# EAGLE design 7seg (EAGLE 6.1)
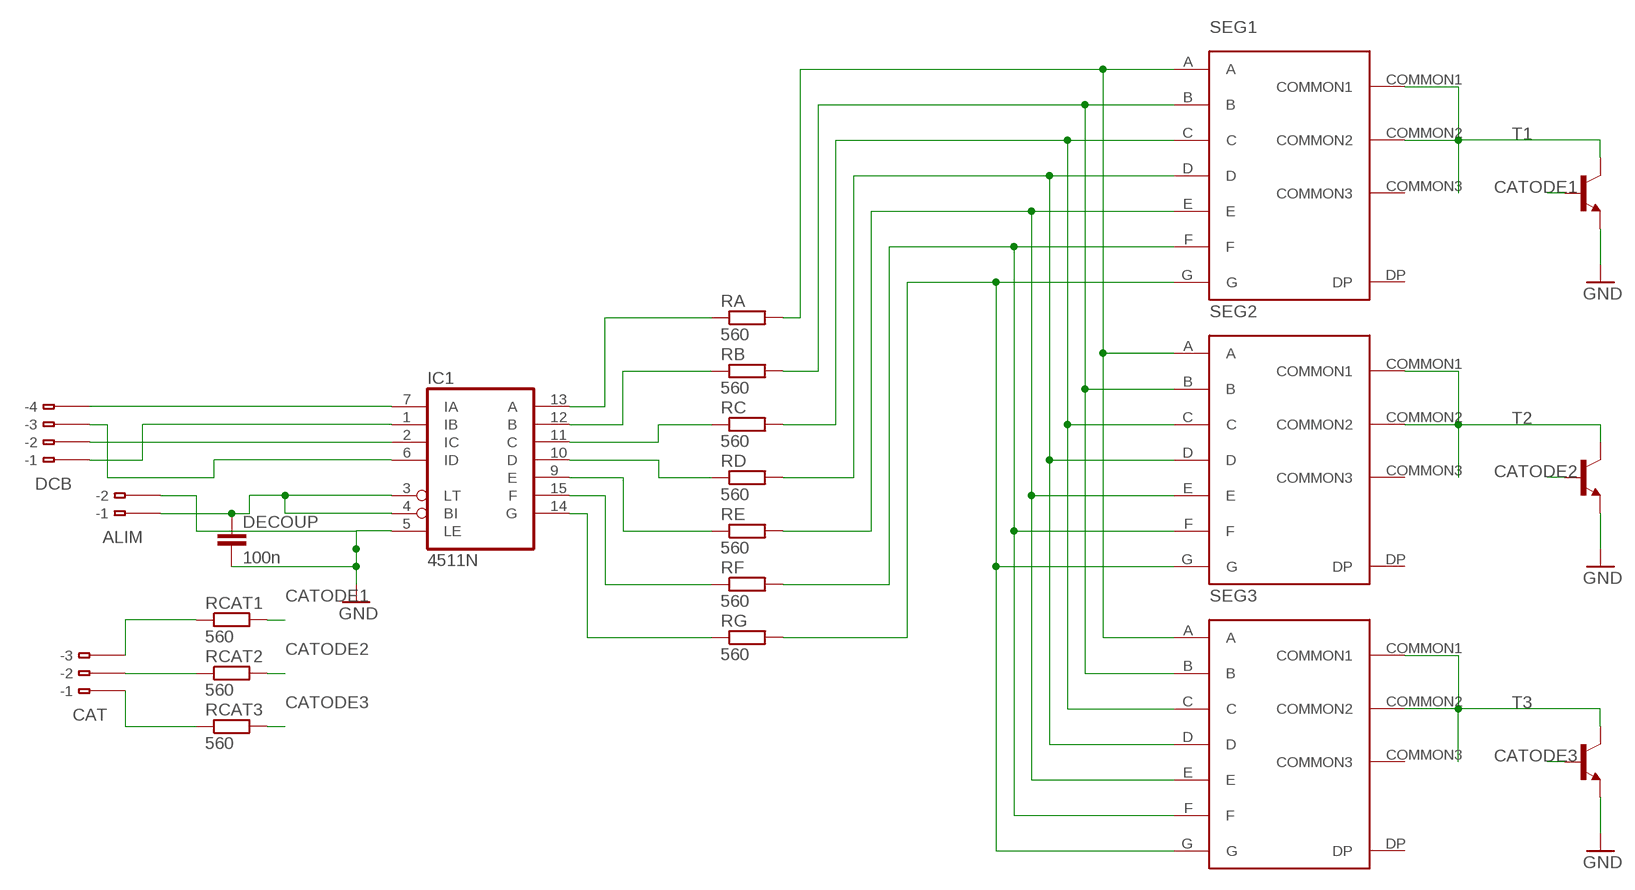
[diagram p0: schematic, sheet 1]

## Parts
ALIM  233-102  [233-102]
CAT  233-103  [233-103]
DCB  233-104  [233-104]
DECOUP  100n  C-EUC2012  [C2012]
IC1  4511N  [DIL16]
RA  560  R-EU_M2012  [M2012]
RB  560  R-EU_M2012  [M2012]
RC  560  R-EU_M2012  [M2012]
RCAT1  560  R-EU_M2012  [M2012]
RCAT2  560  R-EU_M2012  [M2012]
RCAT3  560  R-EU_M2012  [M2012]
RD  560  R-EU_M2012  [M2012]
RE  560  R-EU_M2012  [M2012]
RF  560  R-EU_M2012  [M2012]
RG  560  R-EU_M2012  [M2012]
SEG1  7SEG_33MMMARK1  [7SEG_33MM]
SEG2  7SEG_33MMMARK1  [7SEG_33MM]
SEG3  7SEG_33MMMARK1  [7SEG_33MM]
T1  BF844-NPN-TO92-CBE  [TO92-CBE]
T2  BF844-NPN-TO92-CBE  [TO92-CBE]
T3  BF844-NPN-TO92-CBE  [TO92-CBE]

## Nets
CATODE1: RCAT1.2 T1.B
CATODE2: RCAT2.2 T2.B
CATODE3: RCAT3.2 T3.B
DCB: DCB.B1(B-1) IC1.1(IB)
GND: ALIM.B2(B-2) DECOUP.2 IC1.5(LE) T1.E T2.E T3.E
N$1: RA.2 SEG1.A SEG2.A SEG3.A
N$2: RB.2 SEG1.B SEG2.B SEG3.B
N$3: RC.2 SEG1.C SEG2.C SEG3.C
N$4: RD.2 SEG1.D SEG2.D SEG3.D
N$5: RE.2 SEG1.E SEG2.E SEG3.E
N$6: RF.2 SEG1.F SEG2.F SEG3.F
N$7: RG.2 SEG1.G SEG2.G SEG3.G
N$8: IC1.13(A) RA.1
N$9: IC1.12(B) RB.1
N$10: IC1.11(C) RC.1
N$11: IC1.10(D) RD.1
N$12: IC1.9(E) RE.1
N$13: IC1.15(F) RF.1
N$14: IC1.14(G) RG.1
N$15: SEG1.COMMON1 SEG1.COMMON2 T1.C
N$16: SEG2.COMMON1 SEG2.COMMON2 T2.C
N$17: SEG3.COMMON1 SEG3.COMMON2 T3.C
N$18: DCB.B4(B-4) IC1.7(IA)
N$20: DCB.B2(B-2) IC1.2(IC)
N$21: DCB.B3(B-3) IC1.6(ID)
N$22: ALIM.B1(B-1) DECOUP.1 IC1.3(LT) IC1.4(BI)
N$23: CAT.B3(B-3) RCAT1.1
N$24: CAT.B2(B-2) RCAT2.1
N$25: CAT.B1(B-1) RCAT3.1
Unconnected: ALIM.A1(-1) ALIM.A2(-2) CAT.A1(-1) CAT.A2(-2) CAT.A3(-3) DCB.A1(-1) DCB.A2(-2) DCB.A3(-3) DCB.A4(-4) SEG1.COMMON3 SEG1.DP SEG2.COMMON3 SEG2.DP SEG3.COMMON3 SEG3.DP

## Power pins joined to a net without a drawn wire
VDD: IC1.16(VDD)
VSS: IC1.8(VSS)

## Library data of the parts
ALIM = con-wago:233-102: WAGO Cage Clamp; MPN: 233-102; OC_FARNELL: unknown; OC_NEWARK: 28K9044
CAT = con-wago:233-103: WAGO Cage Clamp; MPN: 233-103; OC_FARNELL: unknown; OC_NEWARK: 28K9045
DCB = con-wago:233-104: WAGO Cage Clamp; MPN: 233-104; OC_FARNELL: unknown; OC_NEWARK: 28K9046
DECOUP = rcl:C-EU: CAPACITOR, European symbol
IC1 = 45xx:4511: BCD to 7-segment LATCH/DECODER/DRIVER
RA RB RC RCAT1-RCAT3 RD RE RF RG = resistor:R-EU_: RESISTOR, European symbol
SEG1-SEG3 = user:7SEG_33MM
T1-T3 = transistor:*-NPN-: NPN Transistror BF959 corrected 2008.03.06

## Board
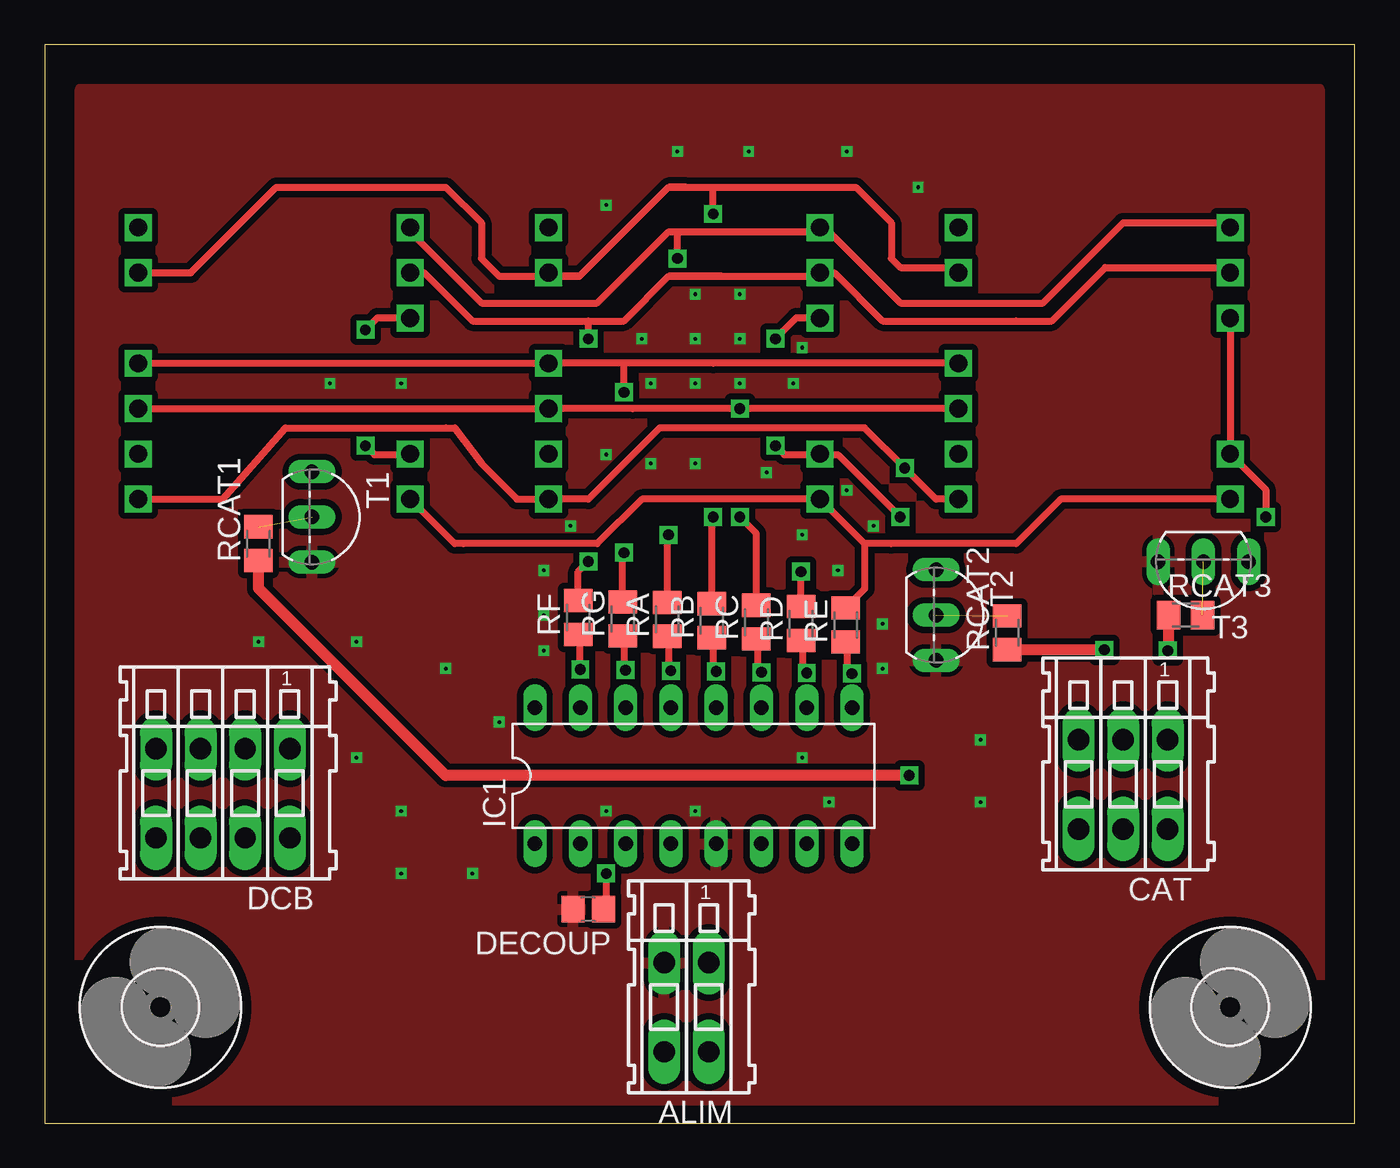
[diagram p1: board, top side]
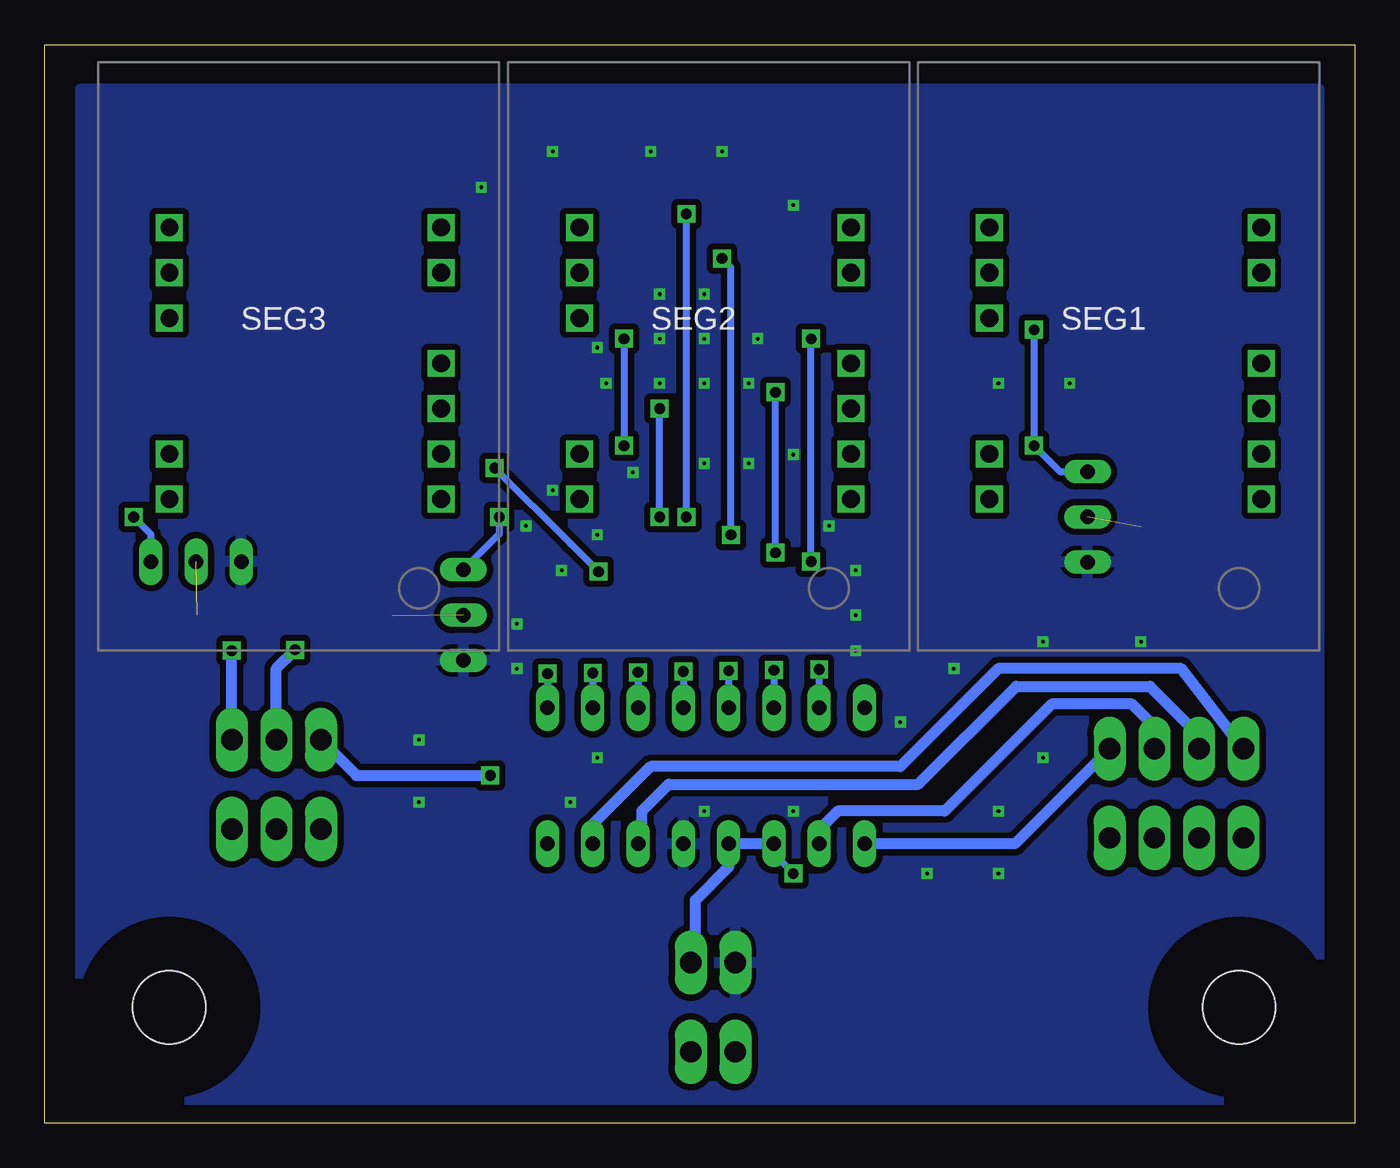
[diagram p2: board, bottom side, seen from below]

Size 73.5 x 60.5 mm. Coordinates in mm from the lower left corner, seen from the top.
Outline: 0,0 73.5,0 73.5,60.5 0,60.5 0,0
Copper layers (1*16): Top 0.035mm / dielectric 1.5mm / Bottom 0.035mm
Design rules: minimum track width 10mil, minimum drill 0.2mm, track to track 14mil, track to pad 8mil, pad to pad 8mil, via to via 8mil, smd to smd 8mil, copper to edge 40mil, drill to drill 8mil, minimum pad ring 10mil, minimum via ring 8mil, stop-mask expansion 4mil, vias tented up to drill 0mil, thermal gap 10mil

### Footprints (pad centres in the part's own frame; a part is rotated, then mirrored left to right if it is on the bottom)
233-102 = drill 1.2 long: A1 -1.25,2.5; A2 1.25,2.5; B1 -1.25,-2.5; B2 1.25,-2.5
233-103 = drill 1.2 long: A1 -2.5,2.5; A2 0,2.5; A3 2.5,2.5; B1 -2.5,-2.5; B2 0,-2.5; B3 2.5,-2.5
233-104 = drill 1.2 long: A1 -3.75,2.5; A2 -1.25,2.5; A3 1.25,2.5; A4 3.75,2.5; B1 -3.75,-2.5; B2 -1.25,-2.5; B3 1.25,-2.5; B4 3.75,-2.5
C2012 = smd 1.3 x 1.5: 1 -0.85,0; 2 0.85,0
DIL16 = drill 0.813 long: 1 -8.89,-3.81; 2 -6.35,-3.81; 3 -3.81,-3.81; 4 -1.27,-3.81; 5 1.27,-3.81; 6 3.81,-3.81; 7 6.35,-3.81; 8 8.89,-3.81; 9 8.89,3.81; 10 6.35,3.81; 11 3.81,3.81; 12 1.27,3.81; 13 -1.27,3.81; 14 -3.81,3.81; 15 -6.35,3.81; 16 -8.89,3.81
M2012 = smd 1.3 x 1.6: 1 -0.95,0; 2 0.95,0
7SEG_33MM = drill 1 square: A 4,23.74; B 19.24,21.2; C 19.24,13.58; COMMON1 4,18.66; COMMON2 4,11.04; COMMON3 19.24,23.74; D 19.24,8.5; DP 19.24,11.04; E 4,8.5; F 4,21.2; G 19.24,16.12
TO92-CBE = drill 0.813 long: B 0,0; C -2.54,0; E 2.54,0
4,1 = hole 4.1: 0,0

### Placement (x,y rotation side)
ALIM  36,6.5 180 top
CAT  60.5,19 180 top
DCB  10,18.5 180 top
DECOUP  30.5,12 180 top
IC1  36.4,19.48 0 top
RA  34.93,28.26 90 top
RB  37.43,28.18 90 top
RC  39.93,28.1 90 top
RCAT1  12,32.5 90 top
RCAT2  54,27.5 90 top
RCAT3  64,28.5 0 top
RD  42.43,28.02 90 top
RE  44.93,27.94 90 top
RF  29.93,28.36 90 top
RG  32.43,28.28 90 top
SEG1  24.5,26.5 0 bottom
SEG2  47.5,26.5 0 bottom
SEG3  70.5,26.5 0 bottom
T1  15,34 270 top
T2  50,28.5 270 top
T3  65,31.5 180 top
U$1  [4,1]  6.5,6.5 0 top
U$2  [4,1]  66.5,6.5 0 top

### Tracks (layer width: path | path; a pad name or v marks a point on that pad's centre or on a via)
CATODE1  (1 unrouted)
CATODE2  (1 unrouted)
CATODE3  (1 unrouted)
DCB
  Bottom 0.61: 19.08,15.67 DCB.B1 19.08,15.67 | 19.08,15.67 IC1.1
GND  (via drill 0.2)
  other vias: 12,27 16,41.5 20,41.5 33.5,44 36.5,44 39,44 36.5,41.5 39,41.5 34,41.5 34,37 36.5,37 31.5,37.5 29.5,33.5 40.5,36.5 42,41.5 42.5,43.5 45,35.5 46.5,33.5 42.5,33 44.5,31 52.5,21.5 52.5,18 17.5,20.5 20,17.5 20,14 24,14 17.5,27 22.5,25.5 25.5,22.5 36.5,17.5 31.5,17.5 42.5,20.5 44,18 31.5,51.5 35.5,54.5 39.5,54.5 45,54.5 49,52.5 36.5,46.5 39,46.5 28,31 28,28.5 28,26.5 47,28 47,25.5
  pour Bottom: 2,58 71.5,58 71.5,1 2,1 2,57.5
  pour Top: 2,58 71.5,58 71.5,1 2,1
N$1  (via drill 0.6)
  Top 0.406: SEG1.A 20.5,50 24.5,46 31,46 35,50 35.5,50 | 35.5,50 39.5,50 43.26,50 SEG2.A 43.76,50.24 48,46 56,46 60.5,50.5 66.24,50.5 SEG3.A | RA.2 34.93,32.93 v35,33 | v35.5,48.5 35.5,50
  Bottom 0.406: v35,33 35,48 v35.5,48.5
N$2  (via drill 0.6)
  Top 0.406: SEG1.B 8.2,47.7 13,52.5 22.5,52.5 24.5,50.5 24.5,48.5 25.5,47.5 28.06,47.5 SEG2.B 28.46,47.5 30,47.5 | 28.5,47.5 28,47.5 28.5,47.5 | 28.5,47.5 30,47.5 | 30,47.5 35,52.5 | 35,52.5 36,52.5 | 36,52.5 37.5,52.5 | 37.5,52.5 45.5,52.5 47.5,50.5 47.5,48.5 48,48 50.96,48 SEG3.B | 36,52.5 35,52.5 | 35,52.5 30,47.5 | RB.2 37.43,33.93 v37.5,34 | v37.5,51 37.5,52.5
  Bottom 0.406: v37.5,34 v37.5,51
N$3  (via drill 0.6)
  Top 0.406: SEG1.C SEG2.C 33,40.08 v39,40.08 SEG3.C | RC.2 39.93,33.07 v39,34
  Bottom 0.406: v39,34 v39,40.08
N$4  (via drill 0.6)
  Top 0.406: SEG1.D 10,35 13.5,39 22.5,39 23,39 24.5,37 26.5,35 SEG2.D 30.5,35 34.5,39 36,39 46,39 v48.25,36.75 50,35 SEG3.D | RD.2 v42.43,30.93
  Bottom 0.406: v42.43,30.93 44,32.5 v48.25,36.75
N$5
  Top 0.406: SEG3.E 57,35 54.5,32.5 47.5,32.5 46,32.5 | 46,32.5 SEG2.E 33.5,35 31,32.5 23.5,32.5 23,32.5 SEG1.E | 46,32.5 46,29.96 RE.2
N$6  (via drill 0.6)
  Top 0.406: SEG1.F 21.3,47.7 24,45 30.5,45 | 30.5,45 32.5,45 | 32.5,45 35,47.5 | 35,47.5 38,47.5 | 38,47.5 43.3,47.5 SEG2.F 44.3,47.7 47,45 54.5,45 56.5,45 59.5,48 66.2,48 SEG3.F | 38,47.5 35,47.5 | 35,47.5 32.5,45 | RF.2 29.93,30.93 v30.5,31.5 | v30.5,44 30.5,45
  Bottom 0.406: v30.5,31.5 v30.5,44
N$7  (via drill 0.6)
  Top 0.406: SEG1.G SEG2.G 32.5,42.62 | SEG3.G 37.5,42.62 32.5,42.62 | RG.2 32.43,31.93 v32.5,32 | v32.5,41 32.5,42.62
  Bottom 0.406: v32.5,32 v32.5,41
N$8  (via drill 0.6)
  Top 0.406: RA.1 35,27.24 35,25.5 v35.13,25.37
  Bottom 0.406: v35.13,25.37 IC1.13
N$9  (via drill 0.6)
  Top 0.406: RB.1 37.5,27.16 37.5,25.5 v37.67,25.33
  Bottom 0.406: v37.67,25.33 IC1.12
N$10  (via drill 0.6)
  Top 0.406: RC.1 40,27.08 40,25.5 v40.21,25.29
  Bottom 0.406: v40.21,25.29 IC1.11
N$11  (via drill 0.6)
  Top 0.406: RD.1 42.5,27 42.5,25.5 v42.75,25.25
  Bottom 0.406: v42.75,25.25 IC1.10
N$12  (via drill 0.6)
  Top 0.406: RE.1 45,26.92 45,25.5 v45.29,25.21
  Bottom 0.406: v45.29,25.21 IC1.9
N$13  (via drill 0.6)
  Top 0.406: RF.1 30,27.34 30,25.5 v30.05,25.45
  Bottom 0.406: v30.05,25.45 IC1.15
N$14  (via drill 0.6)
  Top 0.406: RG.1 32.5,27.26 32.5,25.5 v32.59,25.41
  Bottom 0.406: v32.59,25.41 IC1.14
N$15  (via drill 0.6)
  Top 0.406: SEG1.COMMON1 18.66,45.16 v18,44.5 | v18,38 18.5,37.5 20.46,37.5 SEG1.COMMON2
  Bottom 0.406: v18,44.5 18,39 v18,38 16.54,36.54 T1.C
N$16  (via drill 0.6)
  Top 0.406: SEG2.COMMON1 42.16,45.16 v41,44 | v41,38 41.5,37.5 43.46,37.5 | 43.46,37.5 SEG2.COMMON2 | 43.46,37.5 44.5,37.5 v48,34
  Bottom 0.406: v41,44 v41,38 | v48,34 48,33.04 T2.C
N$17  (via drill 0.6)
  Top 0.406: SEG3.COMMON1 SEG3.COMMON2 68.5,35.54 v68.5,34
  Bottom 0.406: v68.5,34 67.54,33.04 T3.C
N$18
  Bottom 0.61: DCB.B4 9.75,25.5 20,25.5 25.5,20 39.5,20 42.75,16.75 IC1.7
N$20
  Bottom 0.61: DCB.B2 11.5,21.25 11.5,22.5 12.5,23.5 17,23.5 23,17.5 29,17.5 30.05,16.45 IC1.2
N$21
  Bottom 0.61: IC1.6 40,15.88 40,17.5 38.5,19 24.5,19 19,24.5 11.5,24.5 8.75,21.75 DCB.B3
N$22  (via drill 0.6)
  Top 0.406: v31.5,14 31.5,12.15 DECOUP.1
  Bottom 0.406: IC1.3 32.59,15.09 v31.5,14
  Bottom 0.61: IC1.3 IC1.4 35.13,14.37 37,12.5 37,9.25 ALIM.B1
N$23  (via drill 0.6)
  Top 0.61: v48.5,19.5 22.5,19.5 12,30 RCAT1.1
  Bottom 0.61: CAT.B3 56,19.5 v48.5,19.5
N$24  (via drill 0.6)
  Top 0.61: v59.45,26.55 RCAT2.1
  Bottom 0.61: CAT.B2 60.5,25.5 v59.45,26.55
N$25  (via drill 0.6)
  Top 0.61: v63,26.5 63.05,26.55 RCAT3.1
  Bottom 0.61: CAT.B1 v63,26.5